# EAGLE design main (EAGLE 9.6.2)
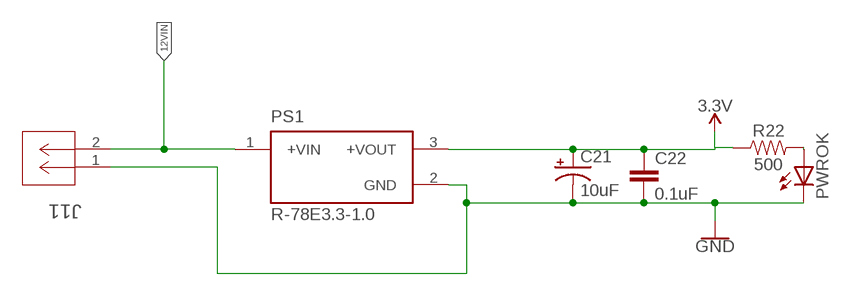
[diagram p0: schematic, sheet 1, part 1 of 2]
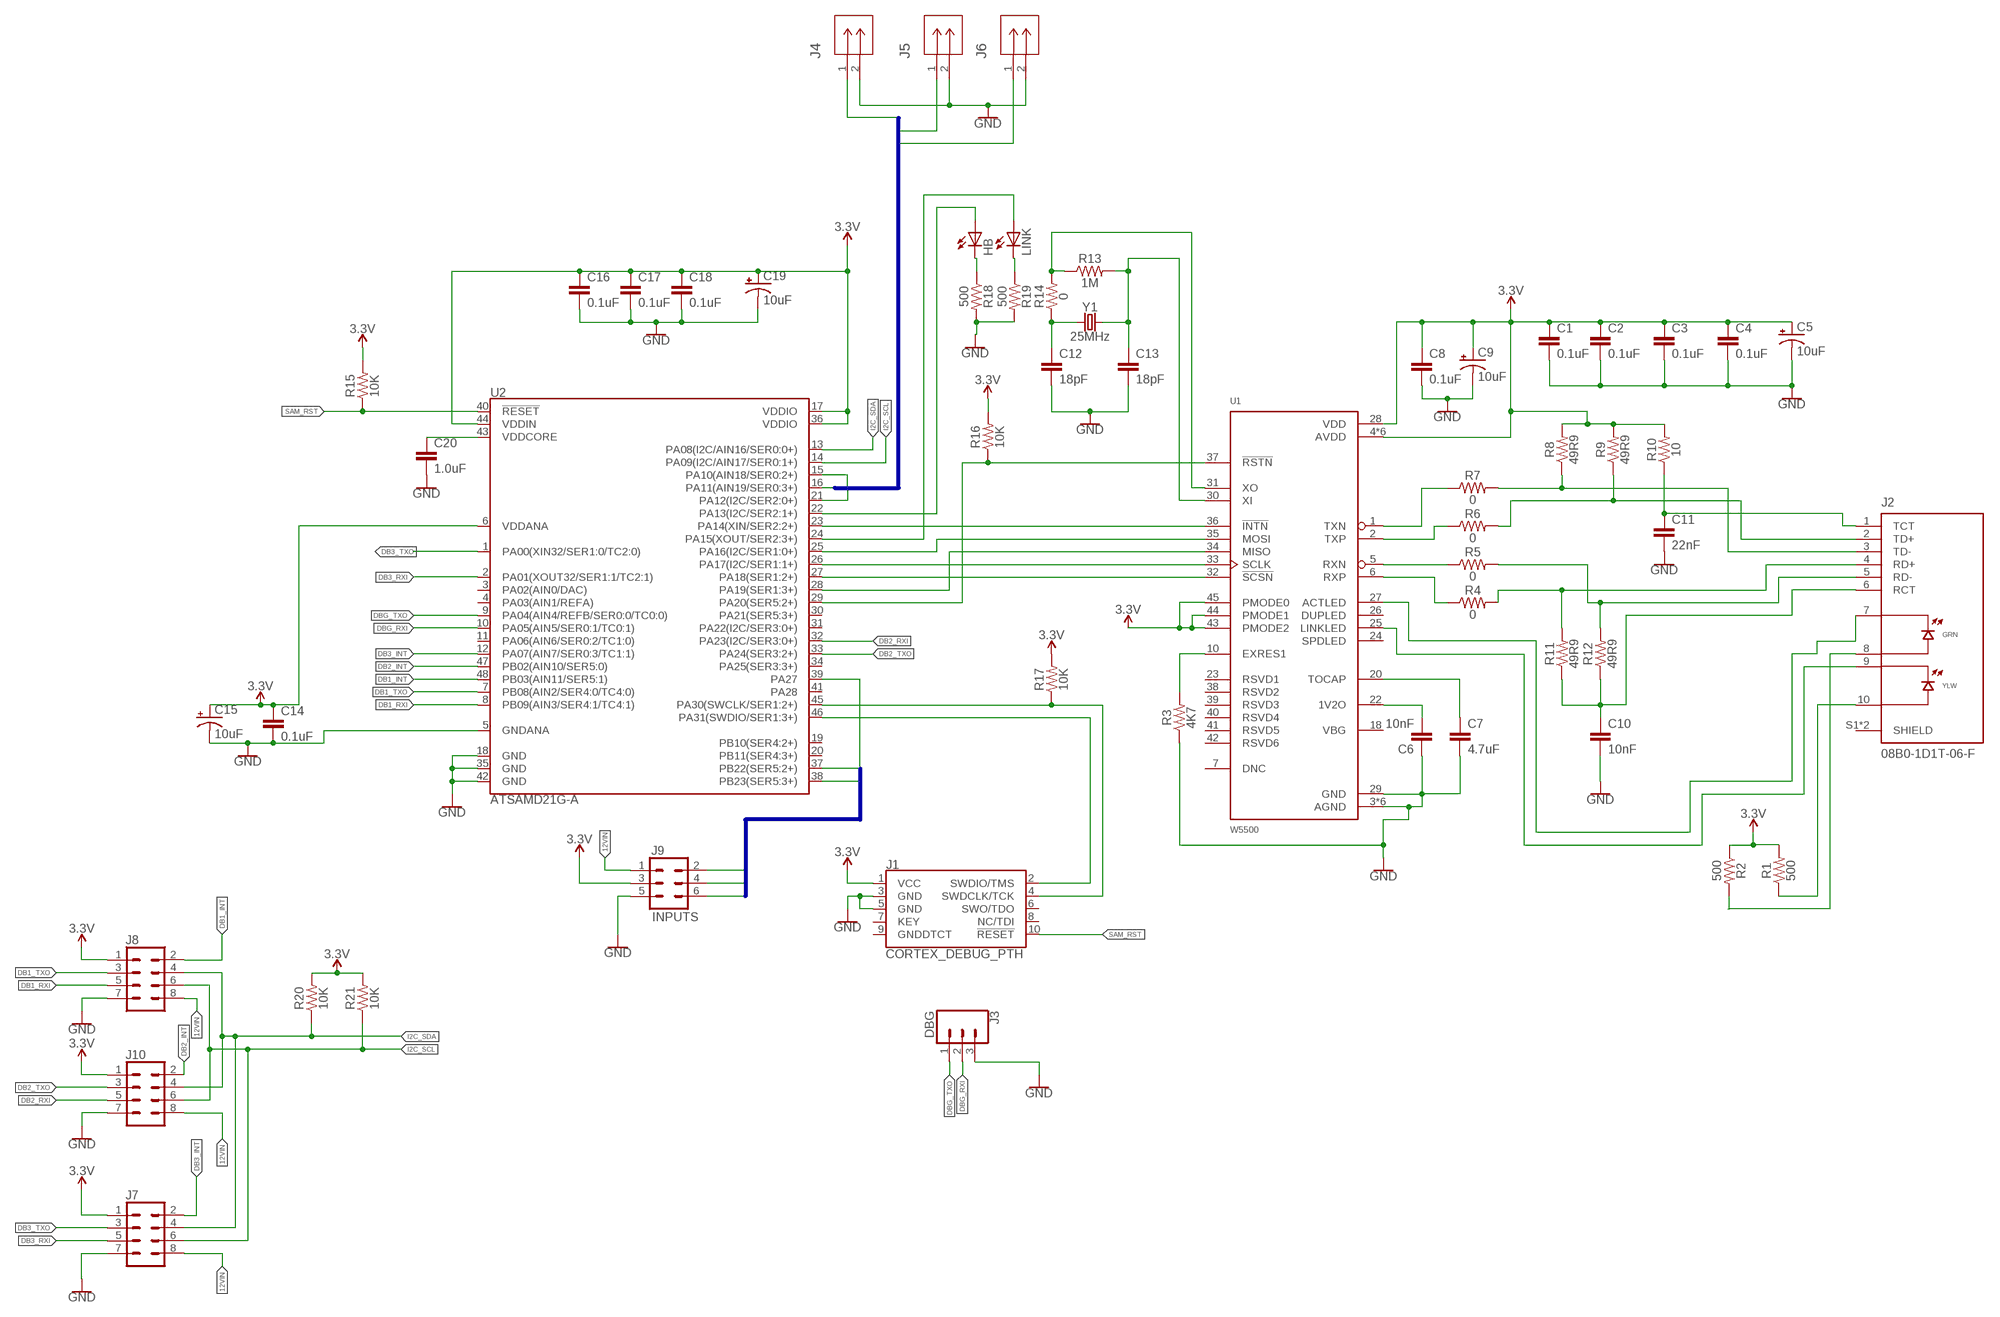
[diagram p1: schematic, sheet 1, part 2 of 2]

## Parts
C1  0.1uF  0.1UF-0603-25V-5%  [0603]
C2  0.1uF  0.1UF-0603-25V-5%  [0603]
C3  0.1uF  0.1UF-0603-25V-5%  [0603]
C4  0.1uF  0.1UF-0603-25V-5%  [0603]
C5  10uF  10UF-POLAR-RADIAL-2.5MM-25V-20%  [CPOL-RADIAL-2.5MM-5MM]
C6  10nF  10NF-0603-50V-10%  [0603]
C7  4.7uF  4.7UF0603  [0603]
C8  0.1uF  0.1UF-0603-25V-5%  [0603]
C9  10uF  10UF-POLAR-RADIAL-2.5MM-25V-20%  [CPOL-RADIAL-2.5MM-5MM]
C10  10nF  10NF-0603-50V-10%  [0603]
C11  22nF  22NF/22,000PF-0603-50V-10%  [0603]
C12  18pF  18PF-0603-50V-5%  [0603]
C13  18pF  18PF-0603-50V-5%  [0603]
C14  0.1uF  0.1UF-0603-25V-5%  [0603]
C15  10uF  10UF-POLAR-RADIAL-2.5MM-25V-20%  [CPOL-RADIAL-2.5MM-5MM]
C16  0.1uF  0.1UF-0603-25V-5%  [0603]
C17  0.1uF  0.1UF-0603-25V-5%  [0603]
C18  0.1uF  0.1UF-0603-25V-5%  [0603]
C19  10uF  10UF-POLAR-RADIAL-2.5MM-25V-20%  [CPOL-RADIAL-2.5MM-5MM]
C20  1.0uF  1.0UF-0603-16V-10%  [0603]
C21  10uF  10UF-POLAR-RADIAL-2.5MM-25V-20%  [CPOL-RADIAL-2.5MM-5MM]
C22  0.1uF  0.1UF-0603-25V-5%  [0603]
HB  LEDCHIPLED_0805  [CHIPLED_0805]
J1  CORTEX_DEBUG_PTH  [2X5-PTH-1.27MM]
J2  08B0-1D1T-06-F  [BEL_08B0-1D1T-06-F]
J3  DBG  CONN_03LOCK  [1X03_LOCK]
J4  GPI1  1725656  [CONN_1725656_PXC]
J5  GPI2  1725656  [CONN_1725656_PXC]
J6  GPI3  1725656  [CONN_1725656_PXC]
J7  CONN_04X2  [2X4]
J8  CONN_04X2  [2X4]
J9  INPUTS  CONN_03X2SHROUD  [2X3-SHROUDED]
J10  CONN_04X2  [2X4]
J11  12V  1725656  [CONN_1725656_PXC]
LINK  LEDCHIPLED_0805  [CHIPLED_0805]
PS1  R-78E3.3-1.0  [CONV_R-78E3.3-1.0]
PWROK  LEDCHIPLED_0805  [CHIPLED_0805]
R1  500  RESISTOR0603  [0603]
R2  500  RESISTOR0603  [0603]
R3  4K7  RESISTOR0603  [0603]
R4  0  RESISTOR0603  [0603]
R5  0  RESISTOR0603  [0603]
R6  0  RESISTOR0603  [0603]
R7  0  RESISTOR0603  [0603]
R8  49R9  RESISTOR0603  [0603]
R9  49R9  RESISTOR0603  [0603]
R10  10  RESISTOR0603  [0603]
R11  49R9  RESISTOR0603  [0603]
R12  49R9  RESISTOR0603  [0603]
R13  1M  RESISTOR0603  [0603]
R14  0  RESISTOR0603  [0603]
R15  10K  RESISTOR0603  [0603]
R16  10K  RESISTOR0603  [0603]
R17  10K  RESISTOR0603  [0603]
R18  500  RESISTOR0603  [0603]
R19  500  RESISTOR0603  [0603]
R20  10K  RESISTOR0603  [0603]
R21  10K  RESISTOR0603  [0603]
R22  500  RESISTOR0603  [0603]
U1  W5500  [QFP50P900X900X160-48N]
U2  ATSAMD21G-A  [TQFP-48]
Y1  25MHz  CRYSTALPTH-HC49US  [HC49US]

## Nets
3.3V: C1.1 C2.1 C3.1 C4.1 C5.1(+) C8.1 C9.1(+) C14.1 C15.1(+) C16.1 C17.1 C18.1 C19.1(+) C21.1(+) C22.1 J1.1(VCC) J7.1 J8.1 J9.3 J10.1 PS1.3(+VOUT) R1.2 R2.1 R8.2 R9.2 R10.2 R15.2 R16.2 R17.2 R20.2 R21.2 R22.1 U1.4(AVDD) U1.8(AVDD) U1.11(AVDD) U1.15(AVDD) U1.17(AVDD) U1.21(AVDD) U1.28(VDD) U1.43(PMODE2) U1.44(PMODE1) U1.45(PMODE0) U2.6(VDDANA) U2.17(VDDIO) U2.36(VDDIO) U2.44(VDDIN)
12VIN: J7.8 J8.8 J9.1 J10.8 J11.2 PS1.1(+VIN)
ACTLED: J2.7 U1.27(ACTLED)
DB1_INT: J8.2 U2.48(PB03(AIN11/SER5:1))
DB1_RXI: J8.5 U2.8(PB09(AIN3/SER4:1/TC4:1))
DB1_TXO: J8.3 U2.7(PB08(AIN2/SER4:0/TC4:0))
DB2_INT: J10.2 U2.47(PB02(AIN10/SER5:0))
DB2_RXI: J10.5 U2.32(PA23(I2C/SER3:0+))
DB2_TXO: J10.3 U2.33(PA24(SER3:2+))
DB3_INT: J7.2 U2.12(PA07(AIN7/SER0:3/TC1:1))
DB3_RXI: J7.5 U2.2(PA01(XOUT32/SER1:1/TC2:1))
DB3_TXO: J7.3 U2.1(PA00(XIN32/SER1:0/TC2:0))
DBG_RXI: J3.2 U2.10(PA05(AIN5/SER0:1/TC0:1))
DBG_TXO: J3.1 U2.9(PA04(AIN4/REFB/SER0:0/TC0:0))
GND: C1.2 C2.2 C3.2 C4.2 C5.2(-) C6.1 C7.2 C8.2 C9.2(-) C10.2 C11.2 C12.2 C13.2 C14.2 C15.2(-) C16.2 C17.2 C18.2 C19.2(-) C20.2 C21.2(-) C22.2 J1.3(GND) J1.5(GND) J3.3 J4.2 J5.2 J6.2 J7.7 J8.7 J9.5 J10.7 J11.1 PS1.2(GND) PWROK.C R3.1 R18.2 R19.2 U1.3(AGND) U1.9(AGND) U1.14(AGND) U1.16(AGND) U1.19(AGND) U1.29(GND) U1.48(AGND) U2.5(GNDANA) U2.18(GND) U2.35(GND) U2.42(GND)
GPI1: J4.1 U2.15(PA10(AIN18/SER0:2+))
GPI2: J5.1 U2.16(PA11(AIN19/SER0:3+))
GPI3: J6.1 U2.21(PA12(I2C/SER2:0+))
I2C_SCL: J7.6 J8.6 J10.6 R21.1 U2.14(PA09(I2C/AIN17/SER0:1+))
I2C_SDA: J7.4 J8.4 J10.4 R20.1 U2.13(PA08(I2C/AIN16/SER0:0+))
INTR: U1.36(!INTN) U2.23(PA14(XIN/SER2:2+))
MISO: U1.34(MISO) U2.28(PA19(SER1:3+))
MOSI: U1.35(MOSI) U2.25(PA16(I2C/SER1:0+))
N$1: J1.4(SWDCLK/TCK) R17.1 U2.45(PA30(SWCLK/SER1:2+))
N$2: J1.2(SWDIO/TMS) U2.46(PA31(SWDIO/SER1:3+))
N$3: PWROK.A R22.2
N$15: J2.10 R1.1
N$16: J2.8 R2.2
N$19: C6.2 U1.22(1V2O)
N$20: C7.1 U1.20(TOCAP)
N$21: R3.2 U1.10(EXRES1)
N$22: C12.1 R14.1 Y1.1
N$28: C11.1 J2.1(TCT) R10.1
N$32: HB.A U2.22(PA13(I2C/SER2:1+))
N$33: HB.C R18.1
N$34: C20.1 U2.43(VDDCORE)
N$35: LINK.A U2.24(PA15(XOUT/SER2:3+))
N$36: LINK.C R19.1
PHYLINK: J2.9 U1.25(LINKLED)
PHYRST: R16.1 U1.37(!RSTN) U2.29(PA20(SER5:2+))
RCT_GND: C10.1 J2.6(RCT) R11.1 R12.1
RX_N [ethdiff]: J2.5(RD-) R5.2 R12.2
RX_P [ethdiff]: J2.4(RD+) R4.2 R11.2
RXP_N [ethdiff]: R5.1 U1.5(RXN)
RXP_P [ethdiff]: R4.1 U1.6(RXP)
SAM_RST: J1.10(!RESET) R15.1 U2.40(!RESET!)
SCLK: U1.33(SCLK) U2.26(PA17(I2C/SER1:1+))
SPI_SS: U1.32(!SCSN) U2.27(PA18(SER1:2+))
SR_CLK: J9.6 U2.39(PA27)
SR_DAT: J9.4 U2.38(PB23(SER5:3+))
SR_LATCH: J9.2 U2.37(PB22(SER5:2+))
TX_N [ethdiff]: J2.3(TD-) R7.2 R8.1
TX_P [ethdiff]: J2.2(TD+) R6.2 R9.1
TXP_N [ethdiff]: R7.1 U1.1(TXN)
TXP_P [ethdiff]: R6.1 U1.2(TXP)
XO_N: R13.1 R14.2 U1.31(XO)
XO_P: C13.1 R13.2 U1.30(XI) Y1.2
Unconnected: J1.6(SWO/TDO) J1.7(KEY) J1.8(NC/TDI) J1.9(GNDDTCT) J2.S1(SHIELD) J2.S2(SHIELD) U1.7(DNC) U1.18(VBG) U1.23(RSVD1) U1.24(SPDLED) U1.26(DUPLED) U1.38(RSVD2) U1.39(RSVD3) U1.40(RSVD4) U1.41(RSVD5) U1.42(RSVD6) U2.3(PA02(AIN0/DAC)) U2.4(PA03(AIN1/REFA)) U2.11(PA06(AIN6/SER0:2/TC1:0)) U2.19(PB10(SER4:2+)) U2.20(PB11(SER4:3+)) U2.30(PA21(SER5:3+)) U2.31(PA22(I2C/SER3:0+)) U2.34(PA25(SER3:3+)) U2.41(PA28)

## Buses
GPI:GPI1,GPI2,GPI3
SHIFTREG:SR_CLK,SR_DAT,SR_LATCH

## Library data of the parts
C1-C4 C8 C14 C16-C18 C22 = SparkFun-Capacitors:0.1UF: 0.1µF ceramic capacitors A capacitor is a passive two-terminal electrical component used to store electrical energy temporarily in an electric field.; PROD_ID: CAP-08604
C5 C9 C15 C19 C21 = SparkFun-Capacitors:10UF-POLAR: 10.0µF polarized capacitors A capacitor is a passive two-terminal electrical component used to store electrical energy temporarily in an electric field.; PROD_ID: CAP-08440
C6 C10 = SparkFun-Capacitors:10NF: 0.01uF/10nF/10,000pF ceramic capacitors A capacitor is a passive two-terminal electrical component used to store electrical energy temporarily in an electric field. CAP-09321; PROD_ID: CAP-00867
C7 = SparkFun-Capacitors:4.7UF: 4.7µF ceramic capacitors A capacitor is a passive two-terminal electrical component used to store electrical energy temporarily in an electric field.; PROD_ID: CAP-08280
C11 = SparkFun-Capacitors:22NF/22,000PF: 0.022uF/22nF/22,000pF ceramic capacitors A capacitor is a passive two-terminal electrical component used to store electrical energy temporarily in an electric field.; PROD_ID: CAP-07885
C12 C13 = SparkFun-Capacitors:18PF: 18pF ceramic capacitors A capacitor is a passive two-terminal electrical component used to store electrical energy temporarily in an electric field.; PROD_ID: CAP-08267
C20 = SparkFun-Capacitors:1.0UF: 1µF ceramic capacitors A capacitor is a passive two-terminal electrical component used to store electrical energy temporarily in an electric field.; PROD_ID: CAP-00868
HB LINK PWROK = adafruit:LED: LED OSRAM: - CHIPLED LG R971, LG N971, LY N971, LG Q971, LY Q971, LO R971, LY R971 LH N974, LH R974 LS Q976, LO Q976, LY Q976 LO Q996 - Hyper CHIPLED LW Q18S LB Q993, LB Q99A, LB R99A - SideLED LS A670, LO A670, LY A670, LG A670, LP A670 LB A673, LV A673, LT A673, LW A673 LH A674 LY A675 LS A676, LA A676, LO A676, LY A676, LW A676 LS A679, LY A679, LG A679 - Hyper Micro SIDELED® LS Y876, LA Y876, LO Y876, LY Y876 LT Y87S - SmartLED LW L88C, LW L88S LB L89C, LB L89S, LG L890 LS L89K, LO L89K, LY L89K LS L896, LA L896, LO L896, LY L896 - TOPLED LS T670, LO T670, LY T670, LG T670, LP T670 LSG T670, LSP T670, LSY T670, LOP T670, LYG T670 LG T671, LOG T671, LSG T671 LB T673, LV T673, LT T673, LW T673 LH T674 LS T676, LA T676, LO T676, LY T676, LB T676, LH T676, LSB T676, LW T676 LB T67C, LV T67C, LT T67C, LS T67K, LO T67K, LY T67K, LW E67C LS E67B, LA E67B, LO E67B, LY E67B, LB E67C, LV E67C, LT E67C LW T67C LS T679, LY T679, LG T679 LS T770, LO T770, LY T770, LG T770, LP T770 LB T773, LV T773, LT T773, LW T773 LH T774 LS E675, LA E675, LY E675, LS T675 LS T776, LA T776, LO T776, LY T776, LB T776 LHGB T686 LT T68C, LB T68C - Hyper Mini TOPLED® LB M676 - Mini TOPLED Santana® LG M470 LS M47K, LO M47K, LY M47K Source: http://www.osram.convergy.de/
J1 = SparkFun-Connectors:CORTEX_DEBUG: Cortex Debug Connector - 10 pin Supports JTAG debug, Serial Wire debug, and Serial Wire Viewer. PTH and SMD connector options available. General Connector Information <http://infocenter.arm.com/help/topic/com.arm.doc.faqs/attached/13634/cortex_debug_connectors.pdf> Products: PTH Connector <http://www.digikey.com/product-detail/en/cnc-tech/3220-10-0100-00/1175-1627-ND/3883661> -via Digi-Key SparkFun PSoc <https://www.sparkfun.com/products/13229> SparkFun T <https://www.sparkfun.com/products/13810>
J2 = 08B0-1D1T-06-F:08B0-1D1T-06-F: MagJack 10/100BASE-T | 1X1 | Y/G LEDs | Tab Up | RoHS Check prices <https://pricing.snapeda.com/parts/08B0-1D1T-06-F/Bel%20Magnetic%20Solutions/view-part?ref=eda>; AVAILABILITY: Good; DESCRIPTION: MagJack 10/100BASE-T | 1X1 | Y/G LEDs | Tab Up | RoHS; MF: Bel Magnetic Solutions; MP: 08B0-1D1T-06-F; PACKAGE: None; PRICE: None; PURCHASE-URL: https://pricing.snapeda.com/search/part/08B0-1D1T-06-F/?ref=eda
J3 = SparkFun-Connectors:CONN_03: Multi connection point. Often used as Generic Header-pin footprint for 0.1 inch spaced/style header connections On any of the 0.1 inch spaced packages, you can populate with these: Break Away Headers - Straight <https://www.sparkfun.com/products/116> (PRT-00116) Break Away Male Headers - Right Angle <https://www.sparkfun.com/products/553> (PRT-00553) Female Headers <https://www.sparkfun.com/products/115> (PRT-00115) Break Away Headers - Machine Pin <https://www.sparkfun.com/products/117> (PRT-00117) Break Away Female Headers - Swiss Machine Pin <https://www.sparkfun.com/products/743> (PRT-00743) Stackable Header - 3 Pin (Female, 0.1") <https://www.sparkfun.com/products/13875> (PRT-13875) For SCREWTERMINALS and SPRING TERMINALS visit here: Screw Terimnals on SparkFun.com <https://www.sparkfun.com/search/results?term=Screw+Terminals> (5mm/3.5mm/2.54mm spacing) This device is also useful as a general connection point to wire up your design to another part of your project. Our various solder wires solder well into these plated through hole pads. Hook-Up Wire - Assortment (Stranded, 22 AWG) <https://www.sparkfun.com/products/11375> (PRT-11375) Hook-Up Wire - Assortment (Solid Core, 22 AWG) <https://www.sparkfun.com/products/11367> (PRT-11367) View the entire wire category on our website here <https://www.sparkfun.com/categories/141> Special notes: Molex polarized connector foot print use with SKU : PRT-08232 with associated crimp pins and housings.
J4-J6 J11 = 1725656:1725656; BUILT_BY: EMA_Cory; COPYRIGHT: Copyright (C) 2018 Accelerated Designs. All rights reserved; MANUFACTURER_PART_NUMBER: 1725656; SOURCELIBRARY: Phoenix_Contact_2020-01-22; VENDOR: Phoenix Contact
J7 J8 J10 = SparkFun-Connectors:CONN_04X2: Multi connection point. Often used as Generic Header-pin footprint for 0.1 inch spaced/style header connections On any of the 0.1 inch spaced packages, you can populate with these: Break Away Headers - Straight <https://www.sparkfun.com/products/116> (PRT-00116) Break Away Male Headers - Right Angle <https://www.sparkfun.com/products/553> (PRT-00553) Female Headers <https://www.sparkfun.com/products/115> (PRT-00115) Break Away Headers - Machine Pin <https://www.sparkfun.com/products/117> (PRT-00117) Break Away Female Headers - Swiss Machine Pin <https://www.sparkfun.com/products/743> (PRT-00743)
J9 = SparkFun-Connectors:CONN_03X2: Multi connection point. Often used as Generic Header-pin footprint for 0.1 inch spaced/style header connections You can populate with any combo of single row headers, but if you'd like an exact match, check these: Header - 2x3 (Male, 0.1") <https://www.sparkfun.com/products/12807> (PRT-12807) Header - 2x3 (Female, 0.1") <https://www.sparkfun.com/products/13010> (PRT-13010) 2x3 Pin Shrouded Header <https://www.sparkfun.com/products/10877> (PRT-10877) On any of the 0.1 inch spaced packages, you can populate with these: Break Away Headers - Straight <https://www.sparkfun.com/products/116> (PRT-00116) Break Away Male Headers - Right Angle <https://www.sparkfun.com/products/553> (PRT-00553) Female Headers <https://www.sparkfun.com/products/115> (PRT-00115) Break Away Headers - Machine Pin <https://www.sparkfun.com/products/117> (PRT-00117) Break Away Female Headers - Swiss Machine Pin <https://www.sparkfun.com/products/743> (PRT-00743) Special note: the shrouded connector mates well with our 3x2 ribbon cables: Ribbon Crimp Connector - 6-pin (2x3, Female) <https://www.sparkfun.com/products/10651> (PRT-10651) Ribbon Cable - 6 wire (15ft) <https://www.sparkfun.com/products/10646> (PRT-10646); PROD_ID: CONN-10681; SF_ID: PRT_10877
PS1 = R-78E3.3-1.0:R-78E3.3-1.0: 1.0 Amp SIP3 Single Output Check prices <https://pricing.snapeda.com/parts/R-78E3.3-1.0/Recom%20Power/view-part?ref=eda>; AVAILABILITY: Good; DESCRIPTION: 1A DC/DC-Converter 'INNOLINE' SIP3 reg; MF: Recom Power; MP: R-78E3.3-1.0; PACKAGE: SIP-3 Recom Power; PRICE: None; PURCHASE-URL: https://pricing.snapeda.com/search/part/R-78E3.3-1.0/?ref=eda
R1-R22 = SparkFun-Resistors:RESISTOR: Generic Resistor Package
U1 = W5500:W5500: Hardwired TCP/IP embedded Ethernet controller Check prices <https://pricing.snapeda.com/parts/W5500/WIZnet/view-part?ref=eda>; AVAILABILITY: Warning; DESCRIPTION: W5500 Ethernet Interface Evaluation Board; MF: WIZnet; MP: W5500; PACKAGE: LQFP-48 Victor Technologies; PRICE: None; PURCHASE-URL: https://pricing.snapeda.com/search/part/W5500/?ref=eda
U2 = SparkFun-IC-Microcontroller:ATSAMD21G: Atmel SAMD21G SMART ARM-Based Microcontroller The Atmel ® | SMART ™ SAM D21 is a series of low-power microcontrollers using the 32-bit ARM ® Cortex ® -M0+ processor, and ranging from 32- to 64-pins with up to 256KB Flash and 32KB of SRAM. The SAM D21 devices operate at a maximum frequency of 48MHz and reach 2.46 CoreMark/MHz. They are designed for simple and intuitive migration with identical peripheral modules, hex compatible code, identical linear address map and pin compatible migration paths between all devices in the product series. All devices include intelligent and flexible peripherals, Atmel Event System for inter-peripheral signaling, and support for capacitive touch button, slider and wheel user interfaces. Datasheet <https://cdn.sparkfun.com/datasheets/Dev/Arduino/Boards/Atmel-42181-SAM-D21_Datasheet.pdf> SparkFun Products SparkFun SAMD21 Mini Breakout <https://www.sparkfun.com/products/13664> (DEV-13664) SparkFun SAMD21 Dev Breakout <https://www.sparkfun.com/products/13672> (DEV-13672); PROD_ID: IC-13064
Y1 = SparkFun-Clocks:CRYSTAL: Crystals (Generic) These are passive quartz crystals, which can be used as a clock source for a microcontroller. Crystal's are two-terminal devices. They require external "load" capacitors to generate an oscillating signal.

## Net classes
1 ethdiff: width 0.152 mm, clearance 0.152 mm

## Board
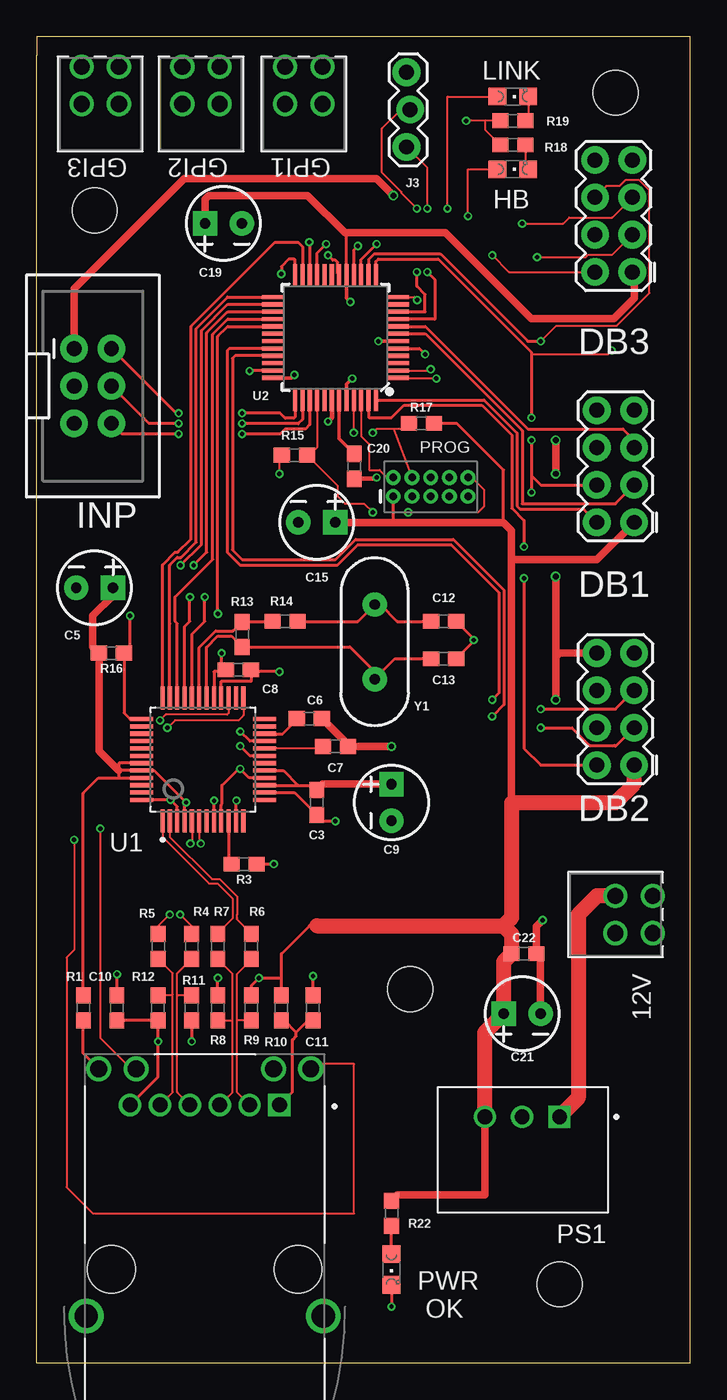
[diagram p2: board, top side]
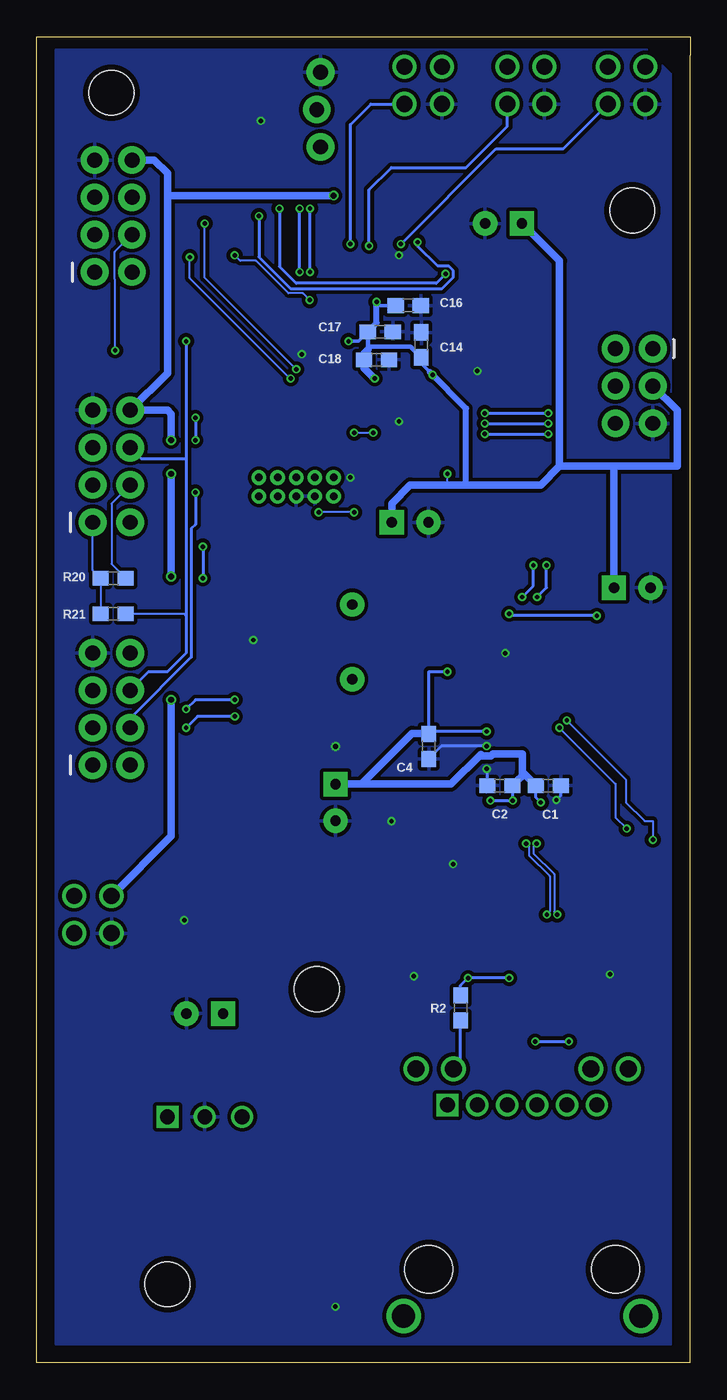
[diagram p3: board, bottom side, seen from below]

Size 44.45 x 90.17 mm. Coordinates in mm from the lower left corner, seen from the top.
Outline: 0,0 0,88.9 0,90.17 44.45,90.17 44.45,0 0,0
Copper layers (1*16): Top 0.035559375mm / dielectric 1.6mm / Bottom 0.035559375mm
Design rules "oshpark-2layer": minimum track width 6mil, minimum drill 10mil, track to track 6mil, track to pad 6mil, pad to pad 6mil, via to via 6mil, smd to smd 6mil, copper to edge 15mil, drill to drill 6mil, minimum pad ring 5mil, minimum via ring 5mil, stop-mask expansion 2.5mil, vias tented up to drill 0mil, thermal gap 10mil
Holes 3.05 mm at 35.56,5.33 25.4,25.4 3.94,78.36 39.37,86.36

### Footprints (pad centres in the part's own frame; a part is rotated, then mirrored left to right if it is on the bottom)
0603 = smd 1.1 x 1: 1 -0.85,0; 2 0.85,0
CPOL-RADIAL-2.5MM-5MM = drill 0.7 pad 1.651 square: 1 1.25,0 | drill 0.7 pad 1.651: 2 -1.25,0
CHIPLED_0805 = smd 1.2 x 1.2: A 0,-1.05; C 0,1.05
2X5-PTH-1.27MM = drill 0.508 pad 1: 1 -2.54,-0.635; 2 -2.54,0.635; 3 -1.27,-0.635; 4 -1.27,0.635; 5 0,-0.635; 6 0,0.635; 7 1.27,-0.635; 8 1.27,0.635; 9 2.54,-0.635; 10 2.54,0.635
BEL_08B0-1D1T-06-F = drill 1.016 square: 1 -5.08,-11.176 | drill 1.016: 2 -3.048,-11.176; 3 -1.016,-11.176; 4 1.016,-11.176; 5 3.048,-11.176; 6 5.08,-11.176 | drill 1.143: 7 -7.214,-13.64; 8 -4.674,-13.64; 9 4.674,-13.64; 10 7.214,-13.64 | drill 1.575: S1 -8.065,3.175; S2 8.065,3.175 | hole 3.251: -6.35,0; 6.35,0
1X03_LOCK = drill 1.016 pad 1.88: 1 0,0.127; 2 2.54,-0.127; 3 5.08,0.127
CONN_1725656_PXC = drill 1.092 pad 1.6: 1 0,0; 2 2.54,0; 3 0,-2.54; 4 2.54,-2.54
2X4 = drill 1.016 pad 1.88: 1 -3.81,-1.27; 2 -3.81,1.27; 3 -1.27,-1.27; 4 -1.27,1.27; 5 1.27,-1.27; 6 1.27,1.27; 7 3.81,-1.27; 8 3.81,1.27
2X3-SHROUDED = drill 1.016 pad 1.88: 1 -1.27,2.54; 2 1.27,2.54; 3 -1.27,0; 4 1.27,0; 5 -1.27,-2.54; 6 1.27,-2.54
CONV_R-78E3.3-1.0 = drill 1 square: 1 -2.54,-2.25 | drill 1: 2 0,-2.25; 3 2.54,-2.25
QFP50P900X900X160-48N = smd 1.56 x 0.28: 1 -4.18,2.75; 2 -4.18,2.25; 3 -4.18,1.75; 4 -4.18,1.25; 5 -4.18,0.75; 6 -4.18,0.25; 7 -4.18,-0.25; 8 -4.18,-0.75; 9 -4.18,-1.25; 10 -4.18,-1.75; 11 -4.18,-2.25; 12 -4.18,-2.75; 25 4.18,-2.75; 26 4.18,-2.25; 27 4.18,-1.75; 28 4.18,-1.25; 29 4.18,-0.75; 30 4.18,-0.25; 31 4.18,0.25; 32 4.18,0.75; 33 4.18,1.25; 34 4.18,1.75; 35 4.18,2.25; 36 4.18,2.75 | smd 0.28 x 1.56: 13 -2.75,-4.18; 14 -2.25,-4.18; 15 -1.75,-4.18; 16 -1.25,-4.18; 17 -0.75,-4.18; 18 -0.25,-4.18; 19 0.25,-4.18; 20 0.75,-4.18; 21 1.25,-4.18; 22 1.75,-4.18; 23 2.25,-4.18; 24 2.75,-4.18; 37 2.75,4.18; 38 2.25,4.18; 39 1.75,4.18; 40 1.25,4.18; 41 0.75,4.18; 42 0.25,4.18; 43 -0.25,4.18; 44 -0.75,4.18; 45 -1.25,4.18; 46 -1.75,4.18; 47 -2.25,4.18; 48 -2.75,4.18
TQFP-48 = smd 1.5 x 0.28: 1 -4.25,2.75; 2 -4.25,2.25; 3 -4.25,1.75; 4 -4.25,1.25; 5 -4.25,0.75; 6 -4.25,0.25; 7 -4.25,-0.25; 8 -4.25,-0.75; 9 -4.25,-1.25; 10 -4.25,-1.75; 11 -4.25,-2.25; 12 -4.25,-2.75; 25 4.25,-2.75; 26 4.25,-2.25; 27 4.25,-1.75; 28 4.25,-1.25; 29 4.25,-0.75; 30 4.25,-0.25; 31 4.25,0.25; 32 4.25,0.75; 33 4.25,1.25; 34 4.25,1.75; 35 4.25,2.25; 36 4.25,2.75 | smd 0.28 x 1.5: 13 -2.75,-4.25; 14 -2.25,-4.25; 15 -1.75,-4.25; 16 -1.25,-4.25; 17 -0.75,-4.25; 18 -0.25,-4.25; 19 0.25,-4.25; 20 0.75,-4.25; 21 1.25,-4.25; 22 1.75,-4.25; 23 2.25,-4.25; 24 2.75,-4.25; 37 2.75,4.25; 38 2.25,4.25; 39 1.75,4.25; 40 1.25,4.25; 41 0.75,4.25; 42 0.25,4.25; 43 -0.25,4.25; 44 -0.75,4.25; 45 -1.25,4.25; 46 -1.75,4.25; 47 -2.25,4.25; 48 -2.75,4.25
HC49US = drill 0.7 pad 1.651: 1 -2.54,0; 2 2.54,0

### Placement (x,y rotation side)
C1  9.65,39.24 0 bottom
C2  12.95,39.24 180 bottom
C3  19.05,38.1 270 top
C4  17.78,41.91 270 bottom
C5  3.94,52.7 0 top
C6  18.54,43.81 180 top
C7  20.32,41.91 0 top
C8  13.72,47.12 180 top
C9  24.13,38.1 90 top
C10  5.46,24.13 90 top
C11  18.8,24.13 90 top
C12  27.69,50.42 0 top
C13  27.69,47.88 0 top
C14  18.29,69.22 90 bottom
C15  19.05,57.15 0 top
C16  19.18,71.88 0 bottom
C17  21.08,70.1 0 bottom
C18  21.34,68.2 0 bottom
C19  12.7,77.47 180 top
C20  21.59,60.96 270 top
C21  33.02,23.75 180 top
C22  33.15,27.81 0 top
HB  32.38,81.15 270 top
J1  26.8,59.56 0 top
J2  11.43,6.35 180 top
J3  25.27,82.68 90 top
J4  19.43,85.6 180 top
J5  12.45,85.6 180 top
J6  5.59,85.6 180 top
J7  39.24,77.98 90 top
J8  39.37,60.96 90 top
J9  3.81,66.42 0 top
J10  39.37,44.45 90 top
J11  39.37,29.21 90 top
LINK  32.38,86.11 270 top
PS1  33.02,14.48 180 top
PWROK  24.13,6.35 180 top
R1  3.17,24.13 90 top
R2  15.62,24.13 270 bottom
R3  14.1,33.91 180 top
R4  10.54,28.32 270 top
R5  8.26,28.32 270 top
R6  14.61,28.32 270 top
R7  12.32,28.32 270 top
R8  12.32,24.13 90 top
R9  14.61,24.13 90 top
R10  16.64,24.13 90 top
R11  10.54,24.13 90 top
R12  8.26,24.13 90 top
R13  13.97,49.53 270 top
R14  16.89,50.42 180 top
R15  17.53,61.72 180 top
R16  5.08,48.26 180 top
R17  26.16,63.88 0 top
R18  32.38,82.8 180 top
R19  32.38,84.45 180 top
R20  39.24,53.34 180 bottom
R21  39.24,50.93 180 bottom
R22  24.13,10.16 270 top
U1  11.3,41.02 90 top
U2  20.32,69.72 180 top
Y1  22.99,49.02 270 top

### Tracks (layer width: path | path; a pad name or v marks a point on that pad's centre or on a via)
3.3V  (via drill 0.3)
  Top 0.152: v16.51,60.45 16.51,61.56 R15.2
  Top 0.203: R8.2 v12.32,26.16 | R9.2 14.61,25.65 v15.11,26.16 16.64,26.16 | R10.2 16.64,26.16 | R1.2 3.17,38.73 4.19,39.75 5.59,39.75 | U1.43 5.59,40.77 5.59,40.26 | 5.59,40.26 5.59,39.75 | 5.59,40.26 5.6,40.27 U1.44 7.99,40.27 v10.16,38.1 10.05,37.99 U1.4 | 5.59,39.75 7.1,39.75 U1.45 | U1.28 12.55,46.34 12.57,46.35 14.61,46.35 14.61,46.99 | 14.61,46.99 14.61,47.08 C8.1 | v16.51,46.99 14.61,46.99 | U1.8 12.05,38.22 v12.06,38.23 | U1.11 13.55,38.19 v13.59,38.23 | U1.21 14.5,42.27 v13.84,42.93 | U1.15 17.78,39.27 | 17.78,39.27 18.73,39.27 C3.1 19.26,39.16 | U1.17 16.78,40.27 17.78,39.27 | 24.26,57.15 J1.1 | U2.17 21.07,76.72 20.95,76.83 | 16.64,26.16 16.64,27.81 18.54,29.72 19.05,29.72 | 31.75,57.15 31.75,60.71 28.57,63.88 R17.2
  Top 0.254: U2.44 21.07,66.54 v21.46,66.93 | U2.6 v23.25,69.47 v23.24,69.47 | U2.17 21.07,72.4 v21.34,72.14 | U2.36 17.32,66.97 v17.53,67.18
  Top 0.508: R22.1 24.55,11.43 30.48,11.43 PS1.3 | C9.1 19.45,39.35 19.26,39.16 | C5.1 5.19,52.18 3.81,50.8 3.81,48.68 R16.2 4.23,41.62 5.59,40.26 | 32.3,54.61 32.3,38.1 | 32.3,54.61 32.3,56.6 31.75,57.15 24.26,57.15 C15.1 | 32.3,54.61 38.1,54.61 J8.1 | C19.1 11.45,79.14 11.68,79.38 18.41,79.38 20.95,76.83 27.81,76.83 33.66,70.99 39.24,70.99 40.64,72.39 40.64,74.04 J7.1
  Top 1.016: PS1.3 30.48,22.46 C21.1 31.77,27.29 C22.1 32.3,29.17 31.75,29.72 | 19.05,29.72 31.75,29.72 | J10.1 40.64,39.37 39.37,38.1 32.3,38.1 32.3,30.27 31.75,29.72
  Bottom 0.152: 16.51,59.69 v16.51,60.45 | J8.1 40.64,53.89 R20.2 R21.2
  Bottom 0.203: v12.32,26.16 v15.11,26.16 15.62,25.65 R2.1 | 11.7,39.64 C2.1 12.06,39.2 v12.06,38.23 v13.59,38.23 | v10.16,38.1 10.5,38.44 C1.1 | v16.51,46.99 17.78,46.99 C4.1 17.74,42.8 17.61,42.93 v13.84,42.93
  Bottom 0.254: v23.24,69.47 22.57,69.47 22.08,69.96 C17.1 | v21.34,72.14 21.08,71.88 C16.1 | v17.53,67.18 17.72,67.37 18.29,67.94 C14.1
  Bottom 0.305: C14.1 19.01,69.09 21.72,69.09 21.91,68.9 21.91,69.79 22.08,69.96
  Bottom 0.406: 15.24,59.69 15.24,64.9 17.72,67.37 | C17.1 21.34,70.7 v21.34,72.14
  Bottom 0.508: 17.74,42.8 18.92,42.8 22.37,39.35 C9.1 16.28,39.35 14.25,41.38 14.13,41.25 13.56,41.25 13.41,41.4 11.43,41.4 11.43,40.17 | 11.43,40.17 11.43,39.92 11.7,39.64 | 11.43,40.17 C1.1 | C15.1 20.3,58.44 19.05,59.69 16.51,59.69 15.24,59.69 10.16,59.69 8.89,60.96 | 8.89,60.96 8.89,74.93 11.43,77.47 C19.1 | J9.3 0.89,64.77 0.89,60.96 5.33,60.96 | 8.89,60.96 5.33,60.96 | 21.91,68.9 22.19,68.62 C18.1 22.19,67.65 v21.46,66.93 | C5.1 5.19,60.81 5.33,60.96
12VIN  (via drill 0.4)
  Top 0.508: v35.31,45.09 35.31,48.01 | 35.31,48.01 35.56,48.26 J10.8 | 35.31,48.01 v35.31,53.47 | v35.31,60.45 v35.31,62.74 | v24.26,79.38 23.11,80.52 10.03,80.52 2.54,73.03 J9.1
  Top 1.016: J11.2 38.1,31.75 36.83,30.48 36.83,18 PS1.1
  Bottom 0.508: J11.2 35.31,35.81 v35.31,45.09 | v35.31,53.47 v35.31,60.45 | v35.31,62.74 35.31,64.52 35.56,64.77 J8.8 35.56,67.31 35.56,79.38 | 35.56,79.38 v24.26,79.38 | 35.56,79.38 35.56,80.9 36.45,81.79 J7.8
ACTLED  (via drill 0.3)
  Top 0.152: U1.27 13.05,44.17 12.95,44.07 8.78,44.07 v8.39,43.68 | v2.54,35.56 2.54,28.07 2.03,27.56 2.03,11.94 3.81,10.16 21.59,10.16 21.59,20.32 18.97,20.32 J2.7
  Bottom 0.152: v8.39,43.68 4.37,39.66 4.37,38.1 3.1,36.83 2.54,36.83 v2.54,35.56
DB1_INT
  Top 0.203: U2.48 30.42,65.47 32.66,63.23 32.66,58.27 32.87,58.06 37.19,58.06 J8.2
DB1_RXI
  Top 0.203: U2.8 26.43,70.47 33.4,63.5 39.88,63.5 40.64,62.74 J8.5
DB1_TXO
  Top 0.203: U2.7 26.43,69.97 33.02,63.38 33.02,58.42 39.37,58.42 J8.3
DB2_INT  (via drill 0.3)
  Top 0.203: U2.47 22.57,64.3 22.61,64.26 24.13,64.26 24.98,65.12 30.27,65.12 32.31,63.08 32.31,58.12 33.15,57.28 v33.15,55.5 | v33.15,53.34 33.15,41.78 34.29,40.64 J10.2
  Bottom 0.203: v33.15,55.5 v33.15,53.34
DB2_RXI  (via drill 0.3)
  Top 0.203: U2.32 13.09,68.97 12.95,68.83 12.95,55.12 13.82,54.25 20.47,54.25 21.84,55.63 28.19,55.63 31.43,52.39 31.43,45.53 v30.99,45.09 | v34.29,44.45 39.37,44.45 J10.5
  Bottom 0.203: v34.29,44.45 33.66,45.09 v30.99,45.09
DB2_TXO  (via drill 0.3)
  Top 0.203: U2.33 13.48,68.47 13.31,68.3 13.31,55.27 13.97,54.61 20.32,54.61 21.69,55.98 28.34,55.98 31.79,52.53 31.79,44.76 v30.98,43.95 | v34.29,43.18 36.41,43.18 37.61,41.99 39.29,41.99 39.37,41.91 J10.3
  Bottom 0.203: v30.98,43.95 32.5,43.95 33.52,43.95 v34.29,43.18
DB3_INT  (via drill 0.3)
  Top 0.152: U2.12 25.68,72.47 v25.89,72.26 | v30.99,75.31 32.13,74.17 J7.2
  Bottom 0.152: v25.89,72.26 26.34,72.72 27.33,72.72 29.54,74.93 30.61,74.93 v30.99,75.31
DB3_RXI  (via drill 0.3)
  Top 0.152: U2.2 26.71,67.47 v26.8,67.56 | v33.02,77.47 35.81,77.47 36.22,77.88 39.14,77.88 J7.5
  Bottom 0.152: v33.02,77.47 33.02,73.79 v26.8,67.56
DB3_TXO  (via drill 0.3)
  Top 0.152: U2.1 27.13,66.97 v27.18,66.93 | v34.04,75.18 37.34,75.18 37.49,75.34 39.14,75.34 J7.3
  Bottom 0.152: v27.18,66.93 27.21,66.93 34.04,73.76 v34.04,75.18
DBG_RXI  (via drill 0.3)
  Top 0.152: v25.86,78.49 24.81,79.53 24.81,79.61 23.5,80.92 23.5,83.95 24.77,85.22 J3.2
  Top 0.203: U2.10 26.42,71.47 26.42,72.64 25.86,73.2 v25.86,74.17
  Bottom 0.203: v25.86,74.17 v25.86,78.49
DBG_TXO  (via drill 0.3)
  Top 0.152: v26.57,78.49 26.57,81.26 J3.1
  Top 0.203: v26.57,74.17 27.07,73.66 27.07,70.95 24.59,70.95 U2.9
  Bottom 0.203: v26.57,74.17 v26.57,78.49
GND  (via drill 0.3, 0.35)
  Top 0.152: R18.2 30.52,83.82 30.52,84.45 | R19.2 30.52,84.45 | 30.52,84.45 v29.21,84.45
  Top 0.203: C10.2 v5.46,26.42 | C12.2 29.68,49.28 | 29.68,49.28 29.72,49.28 v29.72,49.15 | v29.72,49.15 29.72,49.06 C13.2 | 29.68,49.28 29.68,49.19 v29.72,49.15 | C11.2 v18.8,26.29 | R3.1 v16.13,33.91 | PWROK.C v24.13,3.81 | U1.29 12.05,46.98 12.06,46.99 12.74,46.99 C8.2 12.57,47.41 v12.57,48.26 | U1.3 9.55,37.82 v9.1,38.27 U1.48 | U1.9 12.55,37.96 12.6,38.01 12.6,39.27 13.72,40.39 v13.84,40.39 14.46,39.77 U1.16 | U1.19 14.51,41.27 v13.84,41.93 | U1.14 17.53,38.77 C3.2 19.47,36.83 v20.32,36.83 | 34.27,27.54 C22.2 | U2.18 20.46,74.08 20.46,74.83 20.32,74.98 20.15,74.98 v19.81,75.31 | U2.35 14.51,67.47 v14.48,67.44 | U2.5 26.02,68.97 v26.42,68.58
  Top 0.305: C20.2 23.03,60.11 v23.11,60.2 | U2.42 20.07,64.27 v19.81,64.01
  Top 0.508: C21.2 34.27,27.54 | C22.2 34,29.68 v34.42,30.1 | C6.1 21.17,42.04 C7.2 v24.13,41.91
  Bottom 0.203: v9.1,38.27 8.8,38.57 C1.2 | v13.84,40.39 13.84,39.28 C2.2 | v13.84,41.93 16.91,41.93 C4.2
  pour Bottom (isolate 0.254): 1.27,1.27 1.27,87.63 2.92,89.28 43.18,89.28 43.18,1.27
GPI1  (via drill 0.3)
  Top 0.203: U2.15 22.07,75.03 v23.11,76.07
  Bottom 0.203: v23.11,76.07 23.11,84.2 21.72,85.6 J4.1
GPI2  (via drill 0.3)
  Top 0.203: U2.16 21.57,75.67 v21.84,75.95
  Bottom 0.203: v21.84,75.95 21.84,79.76 20.32,81.28 15.24,81.28 12.45,84.07 J5.1
GPI3  (via drill 0.3)
  Top 0.203: U2.21 19.07,75.46 v19.68,76.07
  Bottom 0.203: v19.68,76.07 13.21,82.55 8.64,82.55 J6.1
I2C_SCL  (via drill 0.3)
  Top 0.152: v34.29,69.47 35.33,70.51 39.44,70.51 41.68,72.75 41.68,79.73 41,80.42 40.03,80.42 39.62,80.01 38.73,80.01 J7.6
  Top 0.203: U2.14 22.61,74.01 22.61,75.06 22.96,75.41 27.46,75.41 33.4,69.47 v34.29,69.47
  Bottom 0.152: 34.29,50.8 34.42,50.93 R21.1
  Bottom 0.203: v34.29,69.47 34.29,61.47 | 34.29,61.47 37.34,61.47 J8.6 | 34.29,61.47 34.29,50.8 34.29,48.26 35.56,46.99 36.83,46.99 J10.6
I2C_SDA  (via drill 0.3)
  Top 0.152: 33.66,68.58 38.86,68.58 v39.12,68.83
  Top 0.203: U2.13 23.07,74.89 23.24,75.06 27.31,75.06 33.66,68.71 33.66,68.58 v33.66,64.26 | v33.66,62.74 33.66,60.33 | 33.66,60.33 34.29,59.69 J8.4 | 33.66,60.33 v33.66,59.18
  Bottom 0.152: J8.4 39.37,58.42 39.37,54.32 R20.1 | v39.12,68.83 39.12,73.66 39.14,73.68 39.14,75.54 J7.4
  Bottom 0.203: v33.66,64.26 v33.66,62.74 | v33.66,59.18 33.66,57.01 33.93,56.73 33.93,47.98 38.1,43.81 J10.4
INTR
  Top 0.203: U1.36 8.55,54.26 9.41,55.12 9.6,55.12 10.49,56.01 10.49,70.48 16.2,76.2 17.78,76.2 18.07,75.91 U2.23
MISO
  Top 0.203: U1.34 9.55,50.26 9.4,50.42 9.4,52.07 11.96,54.63 11.96,69.95 12.99,70.97 U2.28
MOSI
  Top 0.203: U1.35 9.05,50.26 9.04,50.27 9.04,54.24 9.56,54.76 9.81,54.76 10.85,55.8 10.85,70.34 12.98,72.47 U2.25
N$1  (via drill 0.3)
  Top 0.152: U2.45 v21.56,63.25 | R17.1 25.45,63.52 24.26,63.52 | 24.26,63.52 J1.4 | v22.86,63.25 23.13,63.52 24.26,63.52
  Bottom 0.152: v22.86,63.25 v21.56,63.25
N$2
  Top 0.152: U2.46 22.07,63.02 22.61,62.48 22.61,60.71 22.61,60.7 23.32,60.7 23.83,60.2 J1.2
N$3
  Top 0.203: PWROK.A R22.2
N$15
  Top 0.203: J2.10 3.17,21.03 R1.1
N$16
  Bottom 0.203: J2.8 15.62,20.47 R2.2
N$19
  Top 0.203: U1.22 16.74,42.77 17.69,43.73 C6.2
N$20
  Top 0.152: C7.1 19.33,41.77 U1.20
N$21
  Top 0.203: U1.10 13.05,34.1 R3.2
N$22
  Top 0.203: R14.1 21.84,50.42 Y1.1 23.37,51.56 24.51,50.42 C12.1
N$28
  Top 0.203: J2.1 17.4,18.41 17.4,21.97 17.65,22.23 17.65,22.48 | 17.65,22.48 18.45,23.28 C11.1 | 17.65,22.48 16.85,23.28 R10.1
N$32  (via drill 0.3)
  Top 0.152: HB.A 29.34,81.15 v29.34,77.98
  Top 0.203: v18.54,76.2 18.57,76.17 U2.22
  Bottom 0.203: v29.34,77.98 29.34,75.19 27.19,73.05 16.88,73.05 16.11,73.82 16.11,74.26 16.42,74.57 17.17,74.57 18.54,75.95 v18.54,76.2
N$33
  Top 0.152: R18.1 33.23,81.35 HB.C
N$34
  Top 0.254: U2.43 20.57,62.83 C20.1
N$35  (via drill 0.3)
  Top 0.152: v27.94,78.49 27.94,86.11 LINK.A
  Top 0.203: U2.24 17.57,75.01 17.53,75.06 17.14,75.06 16.64,74.55 v16.64,74.04
  Bottom 0.203: v16.64,74.04 17.27,73.41 26.8,73.41 27.94,74.55 v27.94,78.49
N$36
  Top 0.152: LINK.C 33.44,84.66 R19.1
PHYLINK  (via drill 0.3)
  Top 0.152: U1.25 14.05,44.02 13.72,43.69 9.4,43.69 v8.89,43.18 | v4.32,36.32 4.32,22.1 6.43,19.99 J2.9
  Bottom 0.152: v8.89,43.18 5.08,39.37 5.08,37.08 v4.32,36.32
PHYRST  (via drill 0.3)
  Top 0.203: U1.37 6.35,43.77 5.93,44.19 R16.1 6.35,48.68 v6.35,50.8 | v12.32,50.93 12.32,69.8 12.99,70.47 U2.29
  Bottom 0.203: v6.35,50.8 12.32,50.8 v12.32,50.93
RCT_GND  (via drill 0.3)
  Top 0.203: J2.6 8.26,19.43 v8.26,21.84 R12.1 C10.1 | R11.1 v10.54,21.84
  Bottom 0.203: v10.54,21.84 v8.26,21.84
RX_N
  Top 0.152: J2.5 9.25,18.39 9.25,25.02 | R12.2 8.29,25.02 9.25,25.02 | R5.2 9.25,26.48 9.25,25.02
RX_P
  Top 0.152: J2.4 9.55,18.39 9.55,25.02 | R11.2 9.59,24.98 9.55,25.02 | R4.2 9.55,26.48 9.55,25.02
RXP_N  (via drill 0.3)
  Top 0.152: v9.04,30.48 8.26,29.69 R5.1 | v10.45,35.31 10.55,35.41 U1.5
  Bottom 0.152: v9.04,30.48 9.25,30.68 9.25,33.23 10.65,34.63 10.65,35.1 v10.45,35.31
RXP_P  (via drill 0.3)
  Top 0.152: v9.75,30.48 10.54,29.69 R4.1 | v11.16,35.31 11.05,35.41 U1.6
  Bottom 0.152: v9.75,30.48 9.55,30.68 9.55,33.1 10.96,34.51 10.96,35.19 11.08,35.31 v11.16,35.31
SAM_RST  (via drill 0.3)
  Top 0.152: U2.40 19.05,65.45 19.05,62.23 18.54,61.72 R15.1 20.45,59.65 20.45,58.93 20.95,58.42 22.27,58.42 v22.86,57.83 | v25.27,57.83 30.04,57.83 30.45,58.24 30.45,59.36 29.61,60.2 J1.10
  Bottom 0.152: v22.86,57.83 v25.27,57.83
SCLK  (via drill 0.3)
  Top 0.203: U1.33 10.05,50.06 10.41,50.42 v10.41,52.07 | v9.78,54.23 11.2,55.65 11.2,70.19 12.98,71.97 U2.26
  Bottom 0.203: v10.41,52.07 9.78,52.7 v9.78,54.23
SPI_SS  (via drill 0.3)
  Top 0.203: U1.32 10.55,49.54 11.43,50.42 v11.43,52.07 | v10.67,54.23 11.56,55.12 11.56,70.04 12.99,71.47 U2.27
  Bottom 0.203: v11.43,52.07 10.67,52.83 v10.67,54.23
SR_CLK  (via drill 0.3)
  Top 0.203: U2.39 18.57,63.78 18.29,63.5 16.89,63.5 16.55,63.16 v13.97,63.16 | J9.6 5.8,63.16 v9.65,63.16
  Bottom 0.203: v13.97,63.16 v9.65,63.16
SR_DAT  (via drill 0.3)
  Top 0.203: U2.38 18.07,64.15 17.78,63.86 13.98,63.86 v13.97,63.87 | J9.4 7.63,63.87 v9.65,63.87
  Bottom 0.203: v13.97,63.87 v9.65,63.87
SR_LATCH  (via drill 0.3)
  Top 0.203: U2.37 17.57,64.31 17.5,64.24 16.89,64.24 16.55,64.58 v13.97,64.58 | J9.2 9.47,64.58 v9.65,64.58
  Bottom 0.203: v13.97,64.58 v9.65,64.58
TX_N
  Top 0.152: J2.3 13.31,18.39 13.31,23.24 | 13.31,23.24 13.31,24.89 13.31,26.43 12.32,27.42 R7.2 | R8.1 13.27,23.28 13.31,23.24
TX_P
  Top 0.152: J2.2 13.61,18.39 13.61,23.24 | 13.61,23.24 13.61,25.02 13.61,26.43 14.61,27.42 R6.2 | R9.1 13.65,23.28 13.61,23.24
TXP_N
  Top 0.152: R7.1 12.32,29.21 13.34,30.23 13.34,30.48 13.34,31.57 12.32,32.59 11.72,32.59 8.55,35.76 U1.1
TXP_P
  Top 0.152: U1.2 9.05,35.76 11.92,32.89 12.45,32.89 13.64,31.7 13.64,30.48 13.64,30.23 13.64,30.14 R6.1
XO_N
  Top 0.203: U1.31 11.05,48.64 12.17,49.76 13.35,49.76 R13.1 14.01,50.42 R14.2
XO_P
  Top 0.203: U1.30 11.55,48.64 12.32,49.4 13.25,49.4 R13.2 21.3,48.68 22.99,46.99 Y1.2 24.38,47.88 C13.1

### Text on the board
tNames: DB3 | PROG | INP | DB1 | DB2 | PWR / OK